# Altium schematic sheet Ethernet.SchDoc
size A3; SheetNumber: 8; SheetTotal: 16
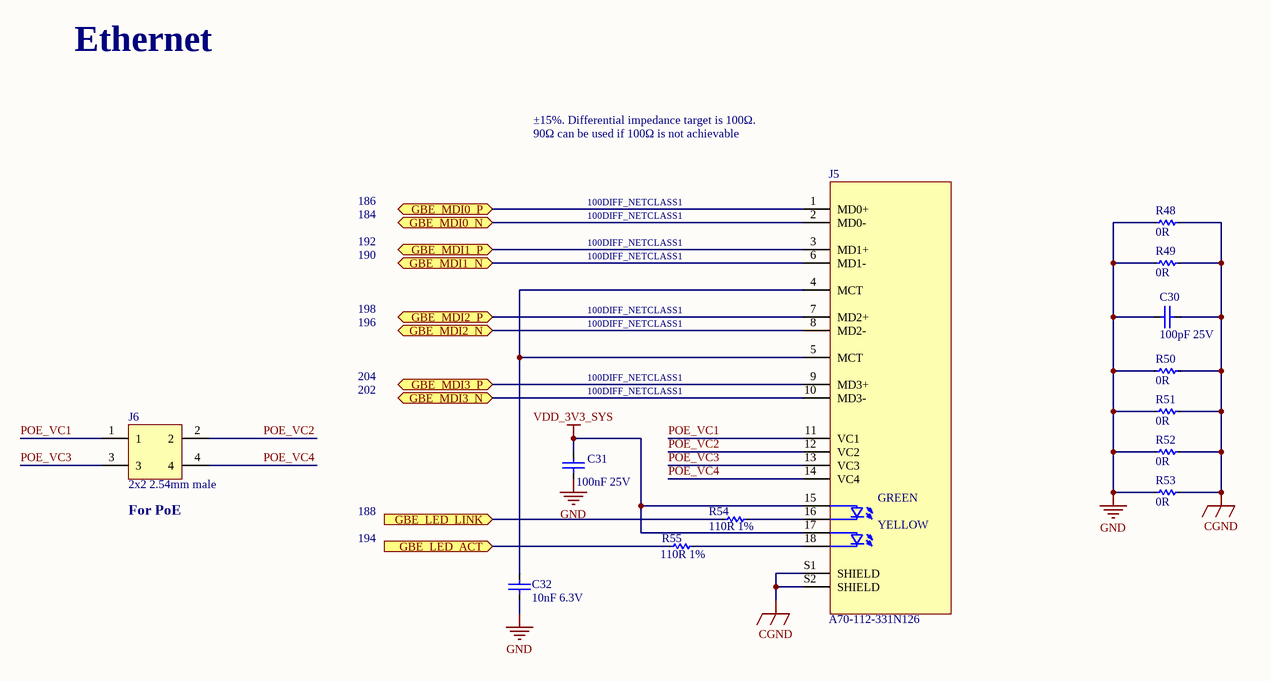
[diagram p0: Ethernet.SchDoc]

## Parts
C30  100pF 25V  [C0402]
C31  100nF 25V  [C0402]
C32  10nF 6.3V  [C0402]
J5  A70-112-331N126  [A70-112-331N126]
J6  2x2 2.54mm male  [PEC02DABN]
R48  0R  [R0603]
R49  0R  [R0603]
R50  0R  [R0603]
R51  0R  [R0603]
R52  0R  [R0603]
R53  0R  [R0603]
R54  110R 1%  [R0402]
R55  110R 1%  [R0402]

## Ports
GBE_LED_ACT (in), GBE_LED_LINK (in), GBE_MDI0_N (bidir), GBE_MDI0_P (bidir), GBE_MDI1_N (bidir), GBE_MDI1_P (bidir), GBE_MDI2_N (bidir), GBE_MDI2_P (bidir), GBE_MDI3_N (bidir), GBE_MDI3_P (bidir)

## Nets
CGND: C30.2 J5.S1(SHIELD) J5.S2(SHIELD) R48.2 R49.2 R50.2 R51.2 R52.2 R53.2
GND: C30.1 C31.1 C32.1 R48.1 R49.1 R50.1 R51.1 R52.1 R53.1
VDD_3V3_SYS: C31.2 J5.15(G_A) J5.17(Y_A)
GBE_LED_ACT: R55.1 ; port GBE_LED_ACT
GBE_LED_LINK: R54.1 ; port GBE_LED_LINK
GBE_MDI0_N: J5.2(MD0-) ; port GBE_MDI0_N
GBE_MDI0_P: J5.1(MD0+) ; port GBE_MDI0_P
GBE_MDI1_N: J5.6(MD1-) ; port GBE_MDI1_N
GBE_MDI1_P: J5.3(MD1+) ; port GBE_MDI1_P
GBE_MDI2_N: J5.8(MD2-) ; port GBE_MDI2_N
GBE_MDI2_P: J5.7(MD2+) ; port GBE_MDI2_P
GBE_MDI3_N: J5.10(MD3-) ; port GBE_MDI3_N
GBE_MDI3_P: J5.9(MD3+) ; port GBE_MDI3_P
POE_VC1: J5.11(VC1) J6.1
POE_VC2: J5.12(VC2) J6.2
POE_VC3: J5.13(VC3) J6.3
POE_VC4: J5.14(VC4) J6.4
NetC32_2: C32.2 J5.4(MCT) J5.5(MCT)
NetJ5_16: J5.16(G_K) R54.2
NetJ5_18: J5.18(Y_K) R55.2

## Notes on the sheet
- Ethernet
- ±15%. Differential impedance target is 100Ω.
- 90Ω can be used if 100Ω is not achievable
- 186
- 184
- 100DIFF_NETCLASS1
- 192
- 190
- 198
- 196
- 204
- 202
- (near J6) For PoE
- 188
- 194
- (in symbol A70-112-331N126) GREEN; YELLOW

## Library data of the parts
C30 = C0402C101J3GACTU: Cap Ceramic 100pF 25V C0G 5% SMD 0402 125C Paper T/R; Manufacturer: KEMET; Temperature Coefficient: 30ppm/°C; Dissipation Factor: 0.1%; Supplier 1: Digi-Key; Manufacturer Part Number: C0402C101J3GACTU; RoHS: Yes; Category: Ceramic Capacitors; Stock 1: 6224680; Pricing 1: 1=0.10000, 10=0.03100, 50=0.01700, 100=0.01390, 500=0.00990, 1000=0.00778, 2500=0.00707, 5000=0.00650 (USD); Mount: Surface Mount; Case/Package: 0402; Number of Pins: 2; Contact Plating: Tin,Matte; Dielectric Material: Ceramic; Case Code (Imperial): 0402; Case Code (Metric): 1005; Min Operating Temperature: -55°C; Max Operating Temperature: 125°C; Capacitance: 100pF; Tolerance: 5%; Packaging: Tape and Reel; Dielectric: C0G; Voltage Rating (DC): 25V; Package Quantity: 1; Voltage Rating: 25V; Termination: SMD/SMT; Voltage: 25V; Series: C0402C; Length: 1mm; Width: 0.02inch; Height: 0.5mm; Depth: 0.5mm; Thickness: 0.022inch; Lead Pitch: 0.3mm; Radiation Hardening: No; Lead Free: Lead Free; Reach SVHC Compliant: Yes; RoHS Compliant: Yes; ComponentLink1URL: http://components.arrow.com/part/dataview/2084787S8438145N7429?src-supplier=Arrow+Electronics; ComponentLink1Description: http://components.arrow.com/part/dataview/2084787S8438145N7429?src-supplier=Arrow+Electronics; ComponentLink2URL: http://www.jameco.com/Jameco/Products/ProdDS/1635286.pdf?src-supplier=Jameco; ComponentLink2Description: http://www.jameco.com/Jameco/Products/ProdDS/1635286.pdf?src-supplier=Jameco; ComponentLink3URL: http://www.farnell.com/datasheets/2739832.pdf?src-supplier=Farnell; ComponentLink3Description: http://www.farnell.com/datasheets/2739832.pdf?src-supplier=Farnell; ComponentLink4URL: http://uk.rs-online.com/webdocs/1443/0900766b81443d93.pdf?src-supplier=RSComponents; ComponentLink4Description: http://uk.rs-online.com/webdocs/1443/0900766b81443d93.pdf?src-supplier=RSComponents; ComponentLink5URL: http://www.mouser.com/ds/2/212/KEM_C1003_C0G_SMD-1101588.pdf?src-supplier=Mouser; ComponentLink5Description: http://www.mouser.com/ds/2/212/KEM_C1003_C0G_SMD-1101588.pdf?src-supplier=Mouser; ComponentLink6URL: http://uk.rs-online.com/webdocs/1443/0900766b81443d94.pdf?src-supplier=RSComponents; ComponentLink6Description: http://uk.rs-online.com/webdocs/1443/0900766b81443d94.pdf?src-supplier=RSComponents; ComponentLink7URL: http://www.farnell.com/datasheets/2739832.pdf?src-supplier=Newark; ComponentLink7Description: http://www.farnell.com/datasheets/2739832.pdf?src-supplier=Newark; ComponentLink8URL: http://www.farnell.com/datasheets/2739832.pdf?src-supplier=Element14; ComponentLink8Description: http://www.farnell.com/datasheets/2739832.pdf?src-supplier=Element14; ComponentLink9URL: https://api.kemet.com/component-edge/download/datasheet/C0402C101J3GACTU.pdf?src-supplier=Digi-Key; ComponentLink9Description: https://api.kemet.com/component-edge/download/datasheet/C0402C101J3GACTU.pdf?src-supplier=Digi-Key; ComponentLink10URL: http://www.farnell.com/datasheets/1372242.pdf?src-supplier=Element14; ComponentLink10Description: http://www.farnell.com/datasheets/1372242.pdf?src-supplier=Element14; Supplier Part Number 1: 399-C0402C101J3GAC7867CT-ND
C31 = TMK105BJ104KV-F: CAP CER 0.1UF 25V X5R 0402 / High Value Multilayer Ceramic Capacitors (High dielectric type); Manufacturer: Taiyo Yuden; Tolerance: 10%; Supplier 1: Digi-Key; Manufacturer Part Number: TMK105BJ104KV-F; RoHS: Yes; Category: Ceramic Capacitors; Stock 1: 11997960; Pricing 1: 1=0.10000, 10=0.03700, 50=0.02000, 100=0.01630, 500=0.01166, 1000=0.00917, 2500=0.00833, 5000=0.00767 (USD); Mount: Surface Mount; Case/Package: 0402; Number of Pins: 2; Case Code (Imperial): 0402; Case Code (Metric): 1005; Weight: 2.3E-05oz; Min Operating Temperature: -55°C; Max Operating Temperature: 85°C; Capacitance: 100nF; Packaging: Tape and Reel; Dielectric: X5R; Voltage Rating (DC): 25V; Voltage Rating: 25V; Package Quantity: 1; Termination: SMD/SMT; Resistor Type: Ceramic; Voltage: 25V; Series: M; Construction: Flat; Length: 1mm; Width: 0.02inch; Height: 0.5mm; Depth: 0.5mm; Thickness: 0.022inch; Reach SVHC Compliant: Yes; Lead Free: Lead Free; Halogen Free: Halogen Free; RoHS Compliant: Yes; Supplier Part Number 1: 587-1456-1-ND
C32 = GRM155R60J103KA01D: 0402 10 nF 6.3V ±10% Tolerance X5R SMT Multilayer Ceramic Capacitor; Manufacturer: Murata; Supplier 1: Mouser; Manufacturer Part Number: GRM155R60J103KA01D; RoHS: Yes; Category: Ceramic Capacitors; Stock 1: 107154; Pricing 1: 1=0.10000, 10=0.01600, 50=0.01600, 100=0.01200, 1000=0.00700, 10000=0.00400 (USD); Mount: Surface Mount; Case/Package: 0402; Case Code (Metric): 1005; Case Code (Imperial): 0402; Min Operating Temperature: -55°C; Max Operating Temperature: 85°C; Capacitance: 10nF; Voltage Rating: 6.3V; Tolerance: 10%; Packaging: Tape and Reel; Voltage Rating (DC): 6.3V; Package Quantity: 10000; Dielectric: X5R; Termination: SMD/SMT; Voltage: 6.3V; Series: GRM; Construction: Flat; Length: 1mm; Width: 0.02inch; Height: 0.5mm; Thickness: 0.022inch; Depth: 0.5mm; Radiation Hardening: No; Lead Free: Lead Free; RoHS Compliant: Yes; ComponentLink1URL: https://datasheet.ciiva.com/5415/product-5415926.pdf?src-supplier=Mouser; ComponentLink1Description: https://datasheet.ciiva.com/5415/product-5415926.pdf?src-supplier=Mouser; ComponentLink2URL: https://datasheet.ciiva.com/6263/partnumbering-e-01-6263692.pdf?src-supplier=Digi-Key; ComponentLink2Description: https://datasheet.ciiva.com/6263/partnumbering-e-01-6263692.pdf?src-supplier=Digi-Key; ComponentLink3URL: https://datasheet.ciiva.com/6263/partnumbering-e-01-6263689.pdf?src-supplier=Digi-Key; ComponentLink3Description: https://datasheet.ciiva.com/6263/partnumbering-e-01-6263689.pdf?src-supplier=Digi-Key; ComponentLink4URL: https://datasheet.ciiva.com/6263/partnumbering-e-01-6263695.pdf?src-supplier=Digi-Key; ComponentLink4Description: https://datasheet.ciiva.com/6263/partnumbering-e-01-6263695.pdf?src-supplier=Digi-Key; ComponentLink5URL: https://datasheet.ciiva.com/11620/product-11620090.pdf?src-supplier=Avnet; ComponentLink5Description: https://datasheet.ciiva.com/11620/product-11620090.pdf?src-supplier=Avnet; Supplier Part Number 1: 81-GRM155R60J103KA1D
J5 = A70-112-331N126: RJ45 MAGNETIC JACK WITH LED; ComponentLink1Description: Datasheet; ComponentLink1URL: https://www.snapeda.com/parts/A70-112-331N126/EDAC/datasheet/
J6 = PEC02DABN: Conn Header Vert 4POS 2.54MM; Manufacturer: Sullins; Number of Positions: 4; Connector Type: Male Pin; Pitch: 0.1inch; Supplier 1: Digi-Key; Manufacturer Part Number: PEC02DABN; RoHS: Yes; Category: Headers and Wire Housings; Stock 1: 2337; Pricing 1: 1=0.34000, 10=0.32000, 25=0.27400, 50=0.23280, 100=0.22380, 250=0.20092, 500=0.19180 (USD); Mount: Through Hole; Housing Material: Plastic; Housing Color: Black; Contact Material: Bronze; Color: Black; Contact Plating: Tin; Package Quantity: 1; Termination: Solder; Gender: Male; Number of Contacts: 4; Number of Rows: 2; Packaging: Bulk; Length: 5.08mm; Width: 5.08mm; Height: 2.54mm; Row Spacing: 0.1inch; Contact Mating Length: 0.23inch; Lead Free: Lead Free; ComponentLink1URL: https://datasheet.ciiva.com/6888/pxcxxdxxn-dwg-6888889.pdf?src-supplier=Digi-Key; ComponentLink1Description: https://datasheet.ciiva.com/6888/pxcxxdxxn-dwg-6888889.pdf?src-supplier=Digi-Key; Supplier Part Number 1: S2022E-02-ND
R48-R53 = CR0603-J/-000ELF: RES SMD 0 OHM JUMPER 1/10W 0603; Manufacturer: Bourns; Resistance: 0mR; Power Rating: 100mW; Tolerance: 1%; Voltage Rating: 50V; Temperature Coefficient: 500ppm/°C; Resistance Tolerance: 5%; Supplier 1: Digi-Key; Manufacturer Part Number: CR0603-J/-000ELF; RoHS: Yes; Category: Chip SMD Resistors; Stock 1: 1690954; Pricing 1: 1=0.10000, 10=0.01300, 25=0.00960, 50=0.00720, 100=0.00540, 250=0.00408, 500=0.00328, 1000=0.00241 (USD); Mount: Surface Mount; Case/Package: 0603; Number of Pins: 2; Case Code (Imperial): 0603; Case Code (Metric): 1608; Contact Plating: Tin; Min Operating Temperature: -55°C; Max Operating Temperature: 155°C; Packaging: Tape and Reel; Package Quantity: 5000; Resistor Type: Thick Film; Termination: SMD/SMT; Max Power Dissipation: 100mW; Voltage Rating (DC): 50V; Series: CR0603; Technology: THICK FILM; Construction: Rectangular; Features: Moisture Resistant; Number of Terminations: 2; Length: 1.6mm; Width: 0.8mm; Height: 0.45mm; Depth: 0.8mm; Thickness: 457um; Radiation Hardening: No; Reach SVHC Compliant: Yes; Military Standard: Not; RoHS Compliant: Yes; ComponentLink1URL: https://datasheet.ciiva.com/11809/0900766b80fcdb72-11809586.pdf?src-supplier=RSComponents; ComponentLink1Description: https://datasheet.ciiva.com/11809/0900766b80fcdb72-11809586.pdf?src-supplier=RSComponents; ComponentLink2URL: https://datasheet.ciiva.com/7001/1902866-7001645.pdf?src-supplier=Newark; ComponentLink2Description: https://datasheet.ciiva.com/7001/1902866-7001645.pdf?src-supplier=Newark; ComponentLink3URL: https://datasheet.ciiva.com/7986/691949-7986171.pdf?src-supplier=Element14; ComponentLink3Description: https://datasheet.ciiva.com/7986/691949-7986171.pdf?src-supplier=Element14; ComponentLink4URL: https://datasheet.ciiva.com/7660/1856384-7660956.pdf?src-supplier=Element14; ComponentLink4Description: https://datasheet.ciiva.com/7660/1856384-7660956.pdf?src-supplier=Element14; ComponentLink5URL: https://datasheet.ciiva.com/22693/1902866-22693213.pdf?src-supplier=Element14; ComponentLink5Description: https://datasheet.ciiva.com/22693/1902866-22693213.pdf?src-supplier=Element14; ComponentLink6URL: https://datasheet.ciiva.com/5545/chpreztr-5545708.pdf?src-supplier=Mouser; ComponentLink6Description: https://datasheet.ciiva.com/5545/chpreztr-5545708.pdf?src-supplier=Mouser; ComponentLink7URL: https://datasheet.ciiva.com/16761/70154685-16761515.pdf?src-supplier=Allied+Electronics; ComponentLink7Description: https://datasheet.ciiva.com/16761/70154685-16761515.pdf?src-supplier=Allied+Electronics; ComponentLink8URL: https://datasheet.ciiva.com/30062/159chpreztr-30062601.pdf?src-supplier=Onlinecomponents.com; ComponentLink8Description: https://datasheet.ciiva.com/30062/159chpreztr-30062601.pdf?src-supplier=Onlinecomponents.com; ComponentLink9URL: https://datasheet.ciiva.com/48692/001055497-da-01-en-smd-wid-cr0603-j-000elf-0-0-ohm-1-10w-48692135.pdf?src-supplier=Conrad; ComponentLink9Description: https://datasheet.ciiva.com/48692/001055497-da-01-en-smd-wid-cr0603-j-000elf-0-0-ohm-1-10w-48692135.pdf?src-supplier=Conrad; Supplier Part Number 1: CR0603-J/-000ELFCT-ND
R54 R55 = RT0402FRE07110RL: High Precision-High Stability Chip Resistor Thin Film 0402 110Ohm 1% Paper T/R; Manufacturer: Yageo; Power Rating: 62.5mW; Voltage Rating (DC): 50V; Temperature Coefficient: 50ppm/°C; Supplier 1: Digi-Key; Manufacturer Part Number: RT0402FRE07110RL; RoHS: Yes; Category: Chip SMD Resistors; Stock 1: 11129; Pricing 1: 1=0.10000, 10=0.07300, 100=0.02970, 500=0.01814, 1000=0.01336, 2500=0.01159, 5000=0.00958 (USD); Case/Package: 0402; Case Code (Imperial): 0402; Case Code (Metric): 1005; Weight: 2.3E-05oz; Min Operating Temperature: -55°C; Max Operating Temperature: 155°C; Resistance: 110R; Packaging: Cut Tape; Tolerance: 1%; Voltage Rating: 50V; Series: RT; Technology: THIN FILM; Termination: SMD/SMT; Package Quantity: 10000; Length: 1mm; Width: 0.5mm; Height: 0.3mm; Lead Free: Lead Free; RoHS Compliant: Yes; ComponentLink1URL: http://www.yageo.com/documents/recent/PYu-RT_1-to-0.01_RoHS_L_9.pdf?src-supplier=Digi-Key; ComponentLink1Description: http://www.yageo.com/documents/recent/PYu-RT_1-to-0.01_RoHS_L_9.pdf?src-supplier=Digi-Key; Supplier Part Number 1: 13-RT0402FRE07110RLCT-ND